# EAGLE design cgs_noise (EAGLE 7.1.0)
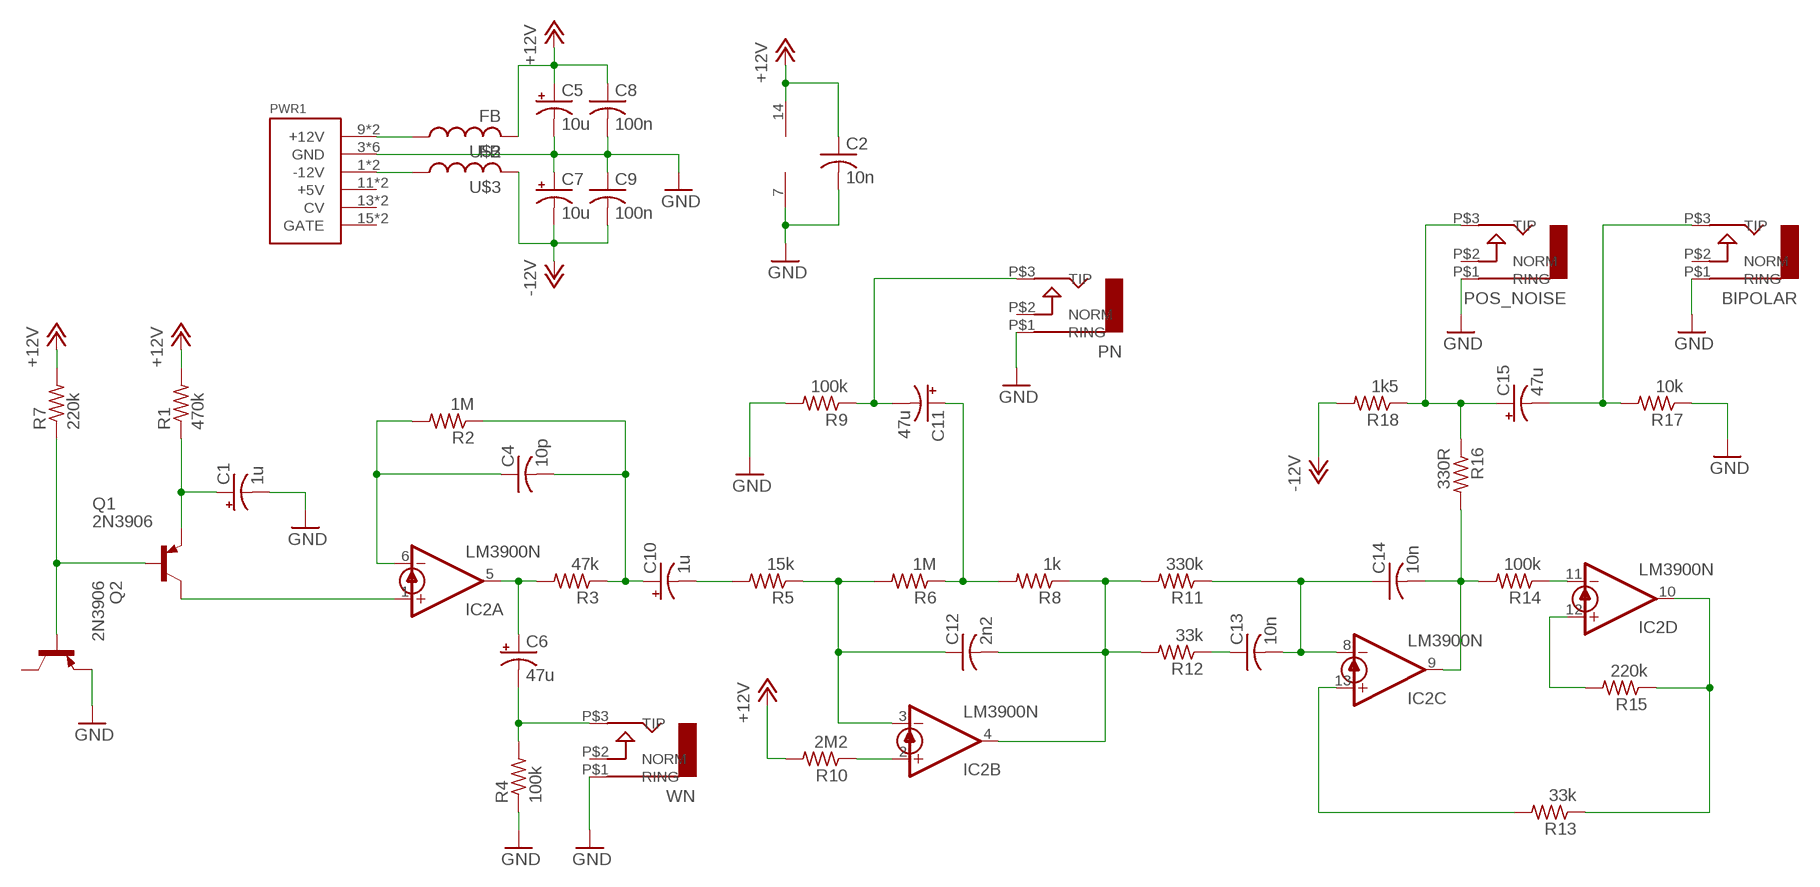
[diagram p0: schematic, sheet 1]

## Parts
BIPOLAR  AUDIO-JACK  [ERTHENVAR-JACK-90DEG]
C1  1u  CPOL-USB45181A  [B45181A]
C2  10n  C-US050-024X044  [C050-024X044]
C4  10p  C-US050-024X044  [C050-024X044]
C5  10u  CPOL-USB45181A  [B45181A]
C6  47u  CPOL-USB45181A  [B45181A]
C7  10u  CPOL-USB45181A  [B45181A]
C8  100n  C-US050-024X044  [C050-024X044]
C9  100n  C-US050-024X044  [C050-024X044]
C10  1u  CPOL-USB45181A  [B45181A]
C11  47u  CPOL-USB45181A  [B45181A]
C12  2n2  C-US050-024X044  [C050-024X044]
C13  10n  C-US050-024X044  [C050-024X044]
C14  10n  C-US050-024X044  [C050-024X044]
C15  47u  CPOL-USB45181A  [B45181A]
IC2  LM3900N  [DIL14]
PN  AUDIO-JACK  [ERTHENVAR-JACK-90DEG]
POS_NOISE  AUDIO-JACK  [ERTHENVAR-JACK-90DEG]
PWR1  POWER  [POWER_16]
Q1  2N3906  [TO92]
Q2  2N3906  [TO92]
R1  470k  R-US_0207/10  [0207/10]
R2  1M  R-US_0207/10  [0207/10]
R3  47k  R-US_0207/10  [0207/10]
R4  100k  R-US_0207/10  [0207/10]
R5  15k  R-US_0207/10  [0207/10]
R6  1M  R-US_0207/10  [0207/10]
R7  220k  R-US_0207/10  [0207/10]
R8  1k  R-US_0207/10  [0207/10]
R9  100k  R-US_0207/10  [0207/10]
R10  2M2  R-US_0207/10  [0207/10]
R11  330k  R-US_0207/10  [0207/10]
R12  33k  R-US_0207/10  [0207/10]
R13  33k  R-US_0207/10  [0207/10]
R14  100k  R-US_0207/10  [0207/10]
R15  220k  R-US_0207/10  [0207/10]
R16  330R  R-US_0207/10  [0207/10]
R17  10k  R-US_0207/10  [0207/10]
R18  1k5  R-US_0207/10  [0207/10]
U$2  FB  [FB]
U$3  FB  [FB]
WN  AUDIO-JACK  [ERTHENVAR-JACK-90DEG]

## Nets
+12V: C2.1 C5.+ C8.1 IC2.14(P:V+) R1.2 R7.2 R10.2 U$2.P$2
-12V: C7.- C9.2 R18.2 U$3.P$2
GND: BIPOLAR.P$1(RING) C1.- C2.2 C5.- C7.+ C8.2 C9.1 IC2.7(P:GND) PN.P$1(RING) POS_NOISE.P$1(RING) PWR1.3(GND) PWR1.4(GND) PWR1.5(GND) PWR1.6(GND) PWR1.7(GND) PWR1.8(GND) Q2.3(E) R4.1 R9.2 R17.1 WN.P$1(RING)
N$1: C1.+ Q1.3(E) R1.1
N$2: Q1.2(B) Q2.2(B) R7.1
N$3: IC2.1(A:+IN) Q1.1(C)
N$4: C6.+ IC2.5(A:OUT) R3.2
N$5: C6.- R4.2 WN.P$3(TIP)
N$6: C4.2 C10.+ R2.1 R3.1
N$7: C4.1 IC2.6(A:-IN) R2.2
N$8: C10.- R5.2
N$9: C12.1 IC2.3(B:-IN) R5.1 R6.2
N$10: C11.+ R6.1 R8.2
N$11: PWR1.9(+12V) PWR1.10(+12V) U$2.P$1
N$12: C12.2 IC2.4(B:OUT) R8.1 R11.2 R12.2
N$13: IC2.13(C:+IN) R13.2
N$14: IC2.2(B:+IN) R10.1
N$15: C14.2 IC2.9(C:OUT) R14.2 R16.2
N$16: C13.2 C14.1 IC2.8(C:-IN) R11.1
N$17: C13.1 R12.1
N$18: PWR1.1(-12V) PWR1.2(-12V) U$3.P$1
N$19: IC2.11(D:-IN) R14.1
N$20: IC2.10(D:OUT) R13.1 R15.1
N$21: IC2.12(D:+IN) R15.2
N$22: BIPOLAR.P$3(TIP) C15.- R17.2
N$23: C15.+ POS_NOISE.P$3(TIP) R16.1 R18.1
N$51: C11.- PN.P$3(TIP) R9.1
Unconnected: BIPOLAR.P$2(NORM) PN.P$2(NORM) POS_NOISE.P$2(NORM) PWR1.11(+5V) PWR1.12(+5V) PWR1.13(CV) PWR1.14(CV) PWR1.15(GATE) PWR1.16(GATE) Q2.1(C) WN.P$2(NORM)

## Library data of the parts
BIPOLAR PN POS_NOISE WN = erthenvar:AUDIO-JACK: Switching Mono 3.5mm Audio Jack from Erthenvar.
C1 C5-C7 C10 C11 C15 = rcl:CPOL-US: POLARIZED CAPACITOR, American symbol
C2 C4 C8 C9 C12-C14 = rcl:C-US: CAPACITOR, American symbol
IC2 = linear:LM3900: OP AMP
PWR1 = eurorack:POWER
Q1 Q2 = transistor-pnp:2N3906: PNP Transistor
R1-R18 = rcl:R-US_: RESISTOR, American symbol
U$2 U$3 = adafruit:FB: Ferrite bead Digikey #P9821BK-ND

## Net classes
1 GND: width 1.016 mm, drill 1.016 mm, clearance 0.508 mm

## Board
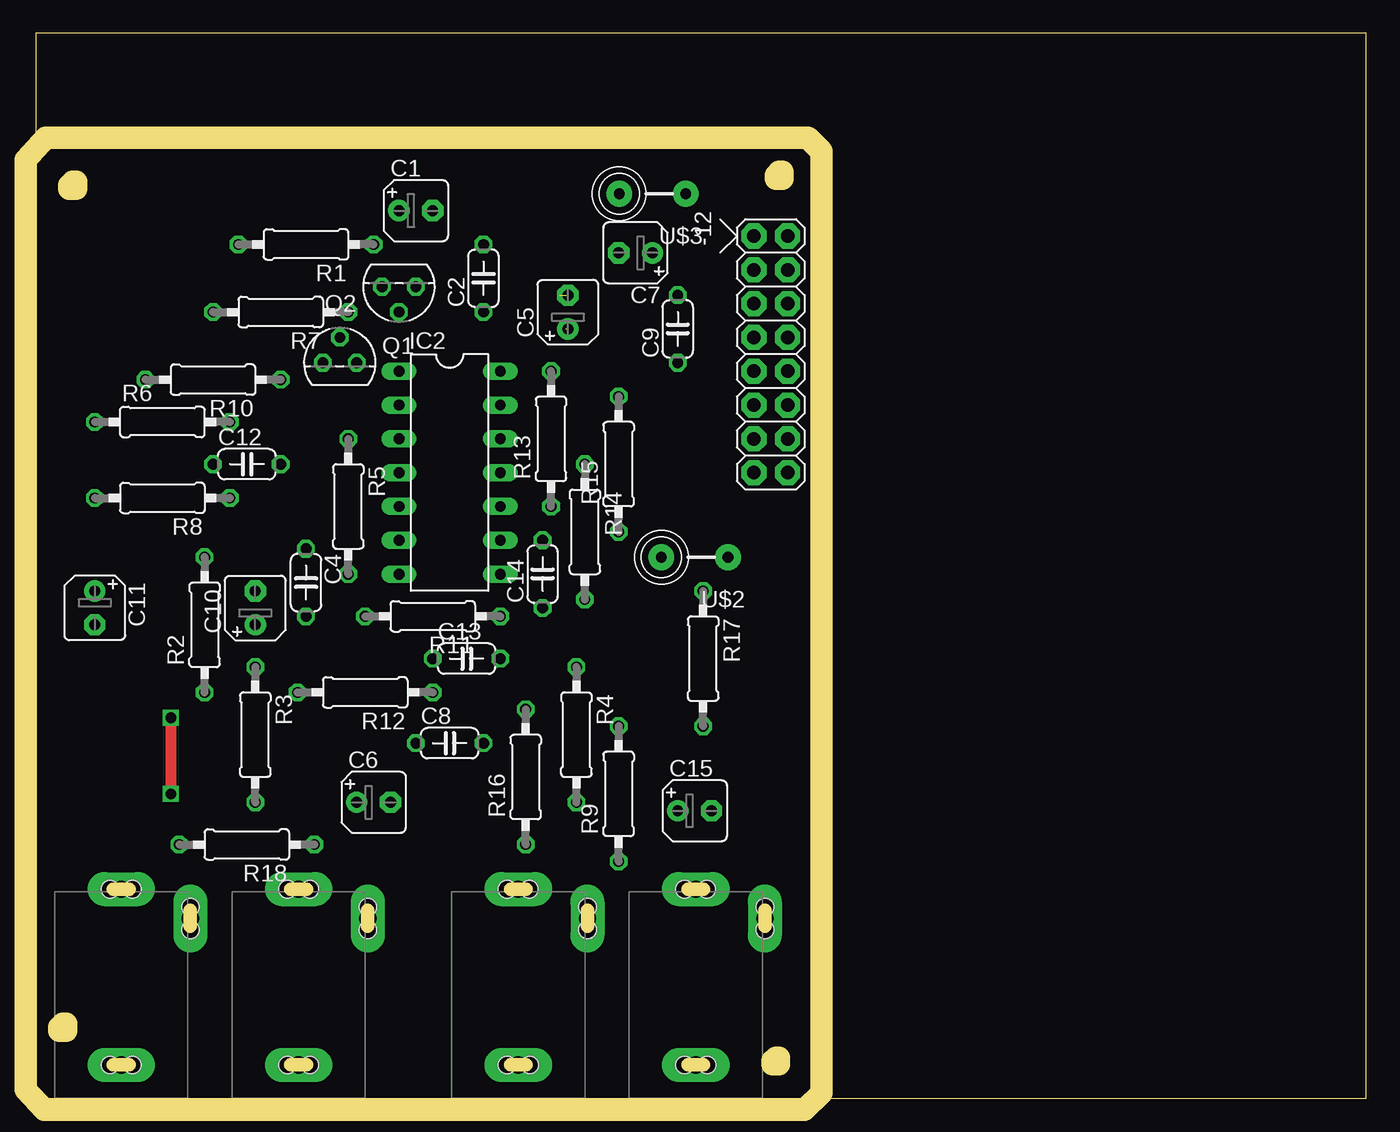
[diagram p1: board, top side]
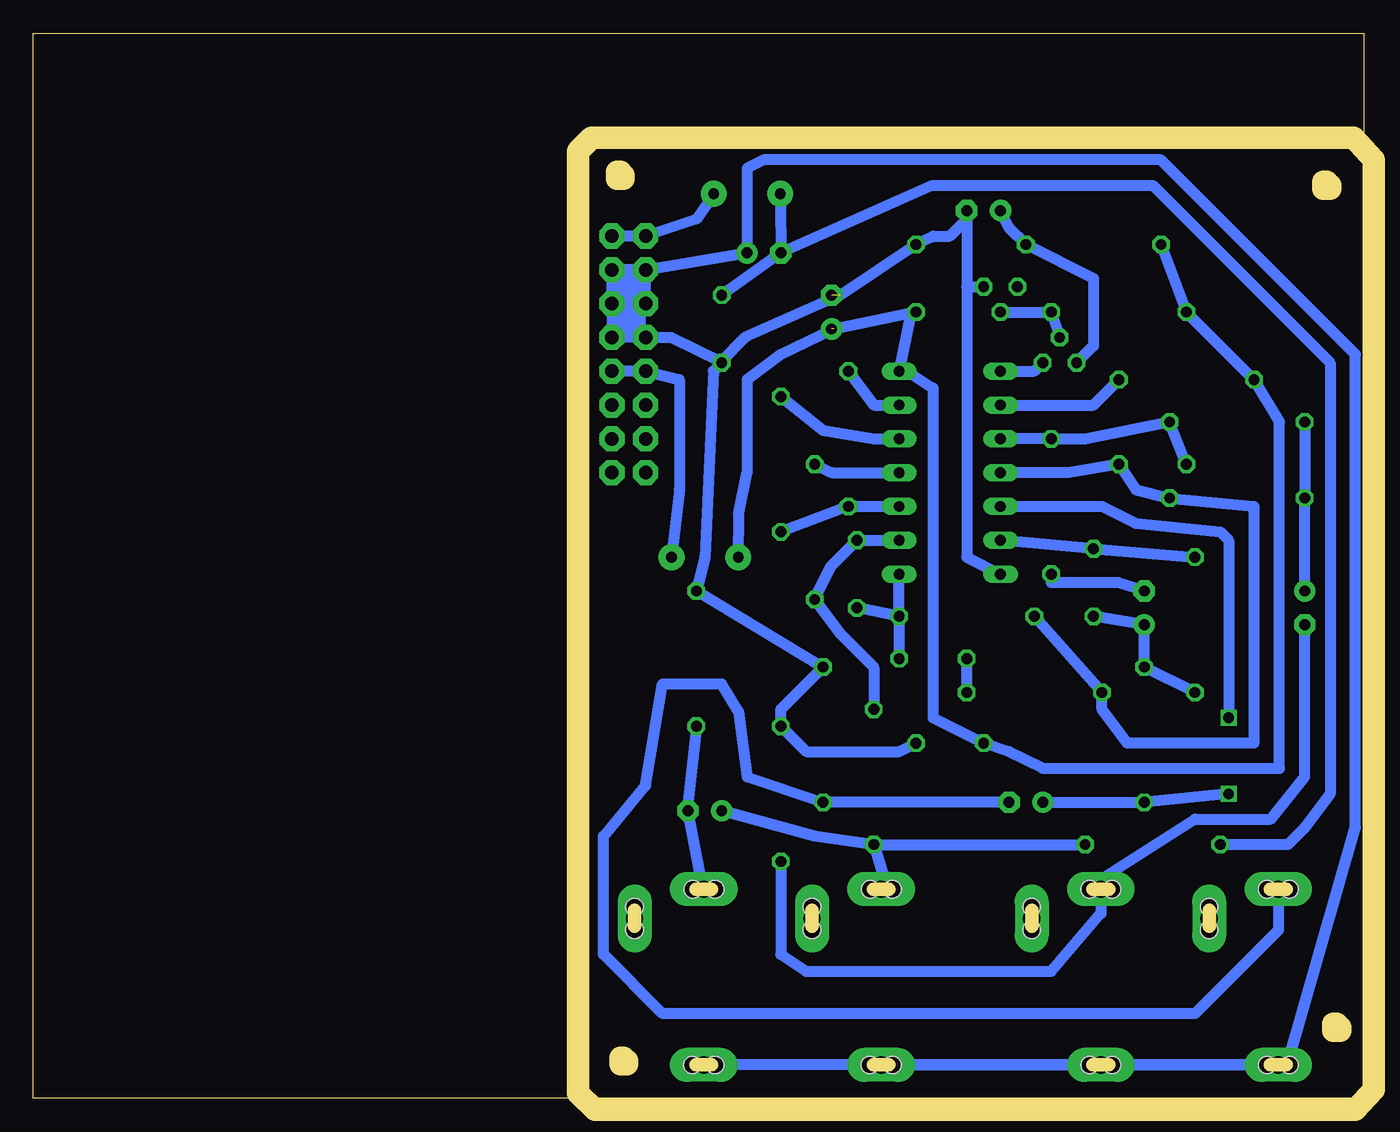
[diagram p2: board, bottom side, seen from below]

Size 100 x 80 mm. Coordinates in mm from the lower left corner, seen from the top.
Outline: 0,0 100,0 100,80 0,80 0,0
Copper layers (1*16): Top 0.035mm / dielectric 1.5mm / Bottom 0.035mm
Design rules "default *": minimum track width 32mil, minimum drill 32mil, track to track 16mil, track to pad 16mil, pad to pad 16mil, via to via 16mil, smd to smd 8mil, copper to edge 0mil, drill to drill 16mil, minimum pad ring 10mil, minimum via ring 8mil, stop-mask expansion 4mil, vias tented up to drill 0mil, thermal gap 10mil
Milling: 24 lines

### Footprints (pad centres in the part's own frame; a part is rotated, then mirrored left to right if it is on the bottom)
ERTHENVAR-JACK-90DEG = drill 1.3 pad 2.54 long: P$1 5,-2.5; P$2 -0.2,-13.5; P$3 5,-15.7 | hole 1.3: 5.842,-2.489; 4.14,-2.489; -0.203,-12.649; -0.203,-14.351; 5.842,-15.697; 4.166,-15.697
B45181A = drill 0.813 pad 1.6: + -1.27,0 | drill 0.813 pad 1.6 octagon: - 1.27,0
C050-024X044 = drill 0.813 octagon: 1 -2.54,0; 2 2.54,0
DIL14 = drill 0.813 long: 1 -7.62,-3.81; 2 -5.08,-3.81; 3 -2.54,-3.81; 4 0,-3.81; 5 2.54,-3.81; 6 5.08,-3.81; 7 7.62,-3.81; 8 7.62,3.81; 9 5.08,3.81; 10 2.54,3.81; 11 0,3.81; 12 -2.54,3.81; 13 -5.08,3.81; 14 -7.62,3.81
POWER_16 = drill 1.016 pad 1.88 octagon: 1 -6.35,-1.27; 2 -6.35,1.27; 3 -3.81,-1.27; 4 -3.81,1.27; 5 -1.27,-1.27; 6 -1.27,1.27; 7 1.27,-1.27; 8 1.27,1.27; 9 3.81,-1.27; 10 3.81,1.27; 11 6.35,-1.27; 12 6.35,1.27; 13 8.89,-1.27; 14 8.89,1.27; 15 11.43,-1.27; 16 11.43,1.27
TO92 = drill 0.813 octagon: 1 1.27,0; 2 0,1.905; 3 -1.27,0
0207/10 = drill 0.813 octagon: 1 -5.08,0; 2 5.08,0
FB = drill 0.8 pad 1.93: P$1 -2.5,0; P$2 2.5,0

### Placement (x,y rotation side)
BIPOLAR  54.61,0 180 top
C1  28.57,66.67 0 top
C2  33.66,61.59 90 top
C4  20.32,38.73 270 top
C5  40.01,59.05 90 top
C6  25.4,22.23 0 top
C7  45.09,63.5 180 top
C8  31.11,26.67 0 top
C9  48.26,57.78 90 top
C10  16.51,36.83 90 top
C11  4.45,36.83 270 top
C12  15.88,47.62 0 top
C13  32.38,33.02 0 top
C14  38.1,39.37 90 top
C15  49.53,21.59 0 top
IC2  31.11,46.99 270 top
PN  24.77,0 180 top
POS_NOISE  41.27,0 180 top
PWR1  55.24,58.42 270 top
Q1  22.86,55.24 0 top
Q2  27.3,60.96 180 top
R1  20.32,64.14 180 top
R2  12.7,35.56 90 top
R3  16.51,27.3 270 top
R4  40.64,27.3 270 top
R5  23.5,44.45 270 top
R6  9.53,50.8 0 top
R7  18.41,59.05 180 top
R8  9.53,45.09 180 top
R9  43.81,22.86 90 top
R10  13.34,53.98 180 top
R11  29.84,36.2 180 top
R12  24.77,30.48 180 top
R13  38.73,49.53 90 top
R14  41.27,42.55 270 top
R15  43.81,47.62 90 top
R16  36.83,24.13 90 top
R17  50.16,33.02 270 top
R18  15.88,19.05 180 top
U$2  49.53,40.64 180 top
U$3  46.35,67.94 180 top
WN  11.43,0 180 top

### Tracks (layer width: path | path; a pad name or v marks a point on that pad's centre or on a via)
+12V  (1 unrouted)
  Bottom 0.813: U$2.P$2 46.99,43.81 46.35,46.99 46.35,53.98 43.81,55.88 39.81,57.78 34.05,59.01 | R1.2 R7.2 R10.2 6.35,50.8 6.35,24.77 24.13,24.77 26.67,26.04 C8.1 32.38,28.57 32.38,53.34 34.29,54.61 IC2.14 34.05,59.01 | C2.1 34.05,59.01
-12V
  Bottom 0.813: R18.2 5.71,19.05 4.45,20.32 2.54,22.86 2.54,55.24 15.88,68.58 32.38,68.58 C7.- | U$3.P$2 43.85,67.27 C7.- | C7.- C9.2
GND  (1 unrouted)
  Bottom 0.813: C8.2 34.92,26.04 41.91,26.04 R9.2 43.81,29.21 R4.1 R17.1 49.53,40.64 48.9,54.61 C9.1 48.33,55.33 | PWR1.3 C7.+ 46.35,69.85 45.09,70.48 15.24,70.48 0.64,55.88 0.64,20.32 5.75,2.5 POS_NOISE.P$1 | PWR1.5 PWR1.3 | PWR1.3 PWR1.4 PWR1.6 PWR1.8 PWR1.7 52.07,57.15 48.33,55.33 | IC2.7 29.84,40.64 29.84,60.96 | 29.84,66.04 29.84,60.96 | 29.84,60.96 Q2.3 | POS_NOISE.P$1 PN.P$1 WN.P$1 | POS_NOISE.P$1 BIPOLAR.P$1 | C1.- 29.84,66.04 | 29.84,66.04 31.11,64.77 32.38,64.77 C2.2 39.37,60.33 46.51,57.15 48.33,55.33
N$1
  Bottom 0.813: Q1.3 20.32,56.52 20.32,61.59 R1.1 26.67,65.41 C1.+
N$2
  Bottom 0.813: Q1.2 R7.1 Q2.2
N$3
  Bottom 0.813: Q1.1 24.77,54.61 IC2.1
N$4  (via drill 0.8)
  Top 0.813: v10.16,28.57 v10.16,22.86
  Bottom 0.813: C6.+ R3.2 v10.16,22.86 | IC2.5 19.68,44.45 17.14,43.18 10.79,42.55 10.16,41.91 v10.16,28.57
N$5
  Bottom 0.813: C6.- R4.2 46.35,24.13 46.99,29.02 48.26,31.11 52.7,31.11 53.98,23.5 57.15,19.68 57.15,10.79 52.7,6.35 12.7,6.35 6.43,12.62 WN.P$3
N$6
  Bottom 0.813: C4.2 C10.+ R3.1 R2.1
N$7
  Bottom 0.813: R2.2 C4.1 IC2.6
N$8
  Bottom 0.813: R5.2 23.5,38.73 18.41,38.73 C10.-
N$9
  Bottom 0.813: C12.1 R6.2 20.95,49.53 R5.1 IC2.3
N$10
  Bottom 0.813: R6.1 R8.2 C11.+
N$11
  Bottom 0.813: PWR1.10 PWR1.9 51.44,53.98 51.44,45.72 U$2.P$1
N$12
  Bottom 0.813: R11.2 R12.2 19.68,29.21 17.78,26.67 8.26,26.67 8.26,44.45 R8.1 17.14,45.72 C12.2 22.23,46.99 IC2.4
N$13
  Bottom 0.813: IC2.13 36.83,52.07 R13.2
N$14
  Bottom 0.813: IC2.2 20.32,52.07 R10.1
N$15
  Bottom 0.813: R16.2 36.83,32.38 39.37,34.92 R14.2 40.01,40.01 C14.2 IC2.9
N$16
  Bottom 0.813: R11.1 C13.2 | R11.1 C14.1 | R11.1 IC2.8
N$17
  Bottom 0.813: R12.1 C13.1
N$18
  Bottom 0.813: PWR1.2 PWR1.1 50.16,66.04 U$3.P$1
N$19
  Bottom 0.813: IC2.11 40.01,46.99 R14.1
N$20
  Bottom 0.813: IC2.10 R13.1 R15.1
N$21
  Bottom 0.813: IC2.12 36.83,49.53 40.64,50.16 R15.2
N$22
  Bottom 0.813: BIPOLAR.P$3 49.61,15.32 C15.- 50.8,22.23 R17.2
N$23
  Bottom 0.813: R16.1 R18.1 | C15.+ 41.27,19.68 R16.1 | R16.1 36.2,16.89 POS_NOISE.P$3
N$51
  Bottom 0.813: C11.- 4.45,24.13 6.99,20.95 12.7,20.95 19.77,16.43 PN.P$3 19.77,13.89 23.5,9.53 41.91,9.53 43.81,10.79 R9.1
(copper drawn outside any net)
  shapes: Bottom area x1